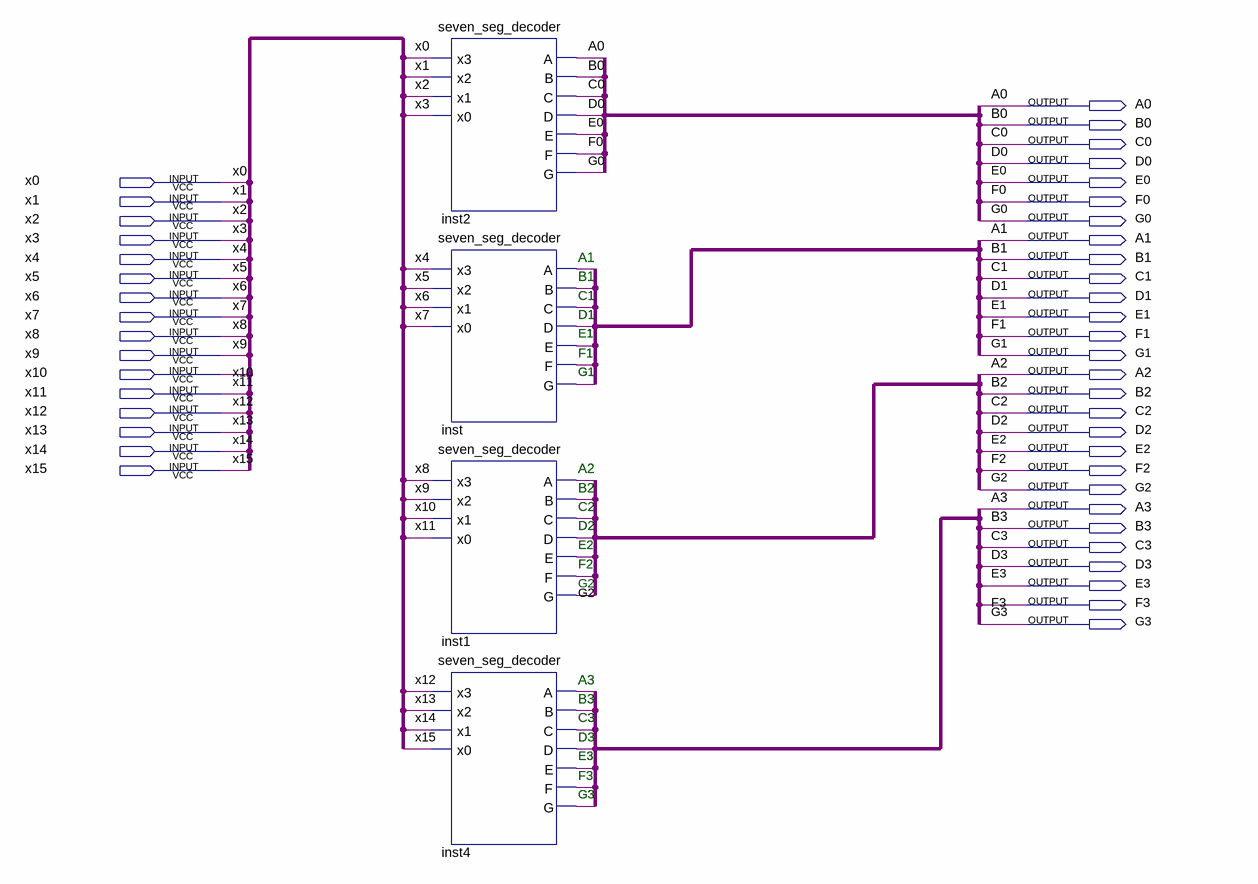
[diagram p0: schematic sheet]
// Quartus schematic lab5step1.bdf as structural Verilog: 4 symbols, 44 pins
module lab5step1 (
  input  x0,
  input  x1,
  input  x2,
  input  x3,
  input  x4,
  input  x5,
  input  x6,
  input  x7,
  input  x8,
  input  x9,
  input  x10,
  input  x11,
  input  x12,
  input  x13,
  input  x14,
  input  x15,
  output A0,
  output B0,
  output C0,
  output D0,
  output E0,
  output F0,
  output G0,
  output A1,
  output B1,
  output C1,
  output D1,
  output E1,
  output F1,
  output G1,
  output A2,
  output B2,
  output C2,
  output D2,
  output E2,
  output F2,
  output G2,
  output A3,
  output B3,
  output C3,
  output D3,
  output E3,
  output F3,
  output G3
);

  seven_seg_decoder inst2 (.x3(x0), .x2(x1), .x1(x2), .x0(x3), .A(A0), .B(B0), .C(C0), .D(D0), .E(E0), .F(F0), .G(G0));
  seven_seg_decoder inst (.x3(x4), .x2(x5), .x1(x6), .x0(x7), .A(A1), .B(B1), .C(C1), .D(D1), .E(E1), .F(F1), .G(G1));
  seven_seg_decoder inst1 (
    .x3(x8), .x2(x9), .x1(x10), .x0(x11), .A(A2), .B(B2), .C(C2), .D(D2), .E(E2), .F(F2), .G(G2));
  seven_seg_decoder inst4 (
    .x3(x12), .x2(x13), .x1(x14), .x0(x15), .A(A3), .B(B3), .C(C3), .D(D3), .E(E3), .F(F3), .G(G3));

  // Notes on the sheet:
  //   A1
  //   B1
  //   C1
  //   D1
  //   E1
  //   F1
  //   G1
  //   A2
  //   B2
  //   C2
  //   D2
  //   E2
  //   F2
  //   G2
  //   A3
  //   B3
  //   C3
  //   D3
  //   E3
  //   F3
  //   G3
endmodule
